# EAGLE schematic Relayschematic (EAGLE 7.5.0)
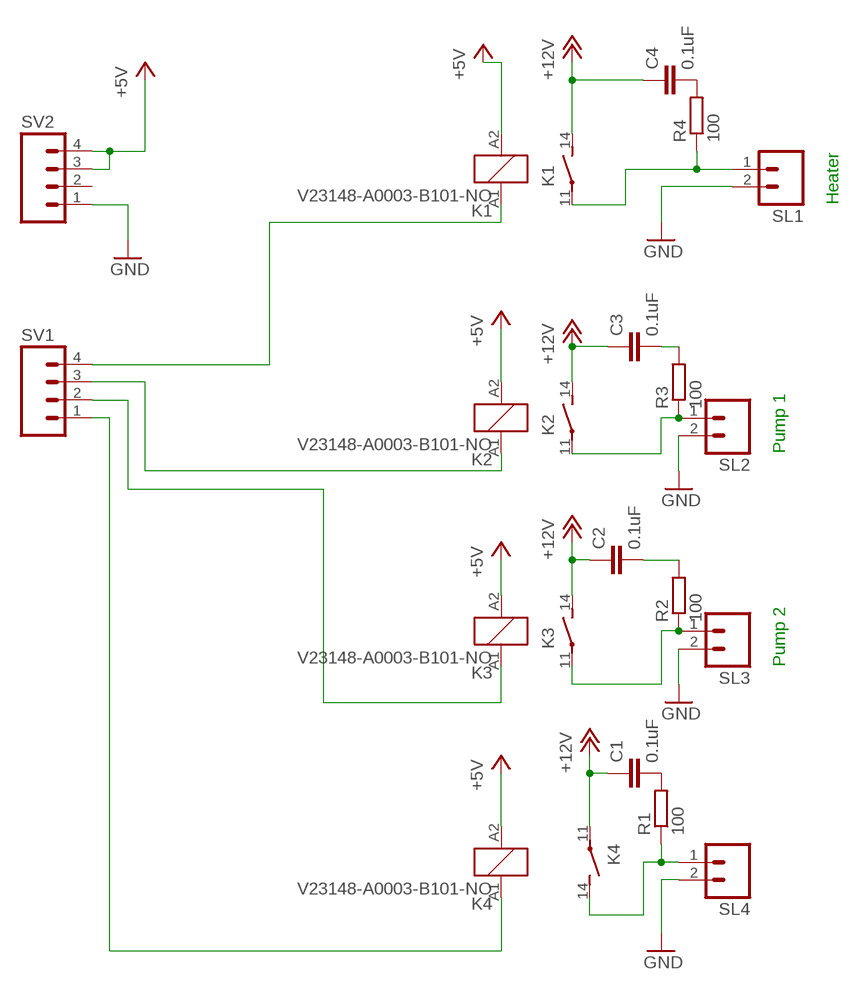
[diagram p0: schematic, sheet 1]

## Parts
C1  0.1uF  C5/2.5  [C5B2.5]
C2  0.1uF  C5/2.5  [C5B2.5]
C3  0.1uF  C5/2.5  [C5B2.5]
C4  0.1uF  C5/2.5  [C5B2.5]
K1  V23148-A0003-B101-NO  [V23148-NO]
K2  V23148-A0003-B101-NO  [V23148-NO]
K3  V23148-A0003-B101-NO  [V23148-NO]
K4  V23148-A0003-B101-NO  [V23148-NO]
R1  100  R-EU_0207/10  [0207/10]
R2  100  R-EU_0207/10  [0207/10]
R3  100  R-EU_0207/10  [0207/10]
R4  100  R-EU_0207/10  [0207/10]
SL1  MA02  [02PA]
SL2  MA02  [02PA]
SL3  MA02  [02PA]
SL4  MA02  [02PA]
SV1  MA04  [04PA]
SV2  MA04  [04PA]

## Nets
+5V: K1.A2 K2.A2 K3.A2 K4.A2 SV2.3 SV2.4
+12V: C1.1 C2.1 C3.1 C4.1 K1.14(2:S) K2.14(2:S) K3.14(2:S) K4.11(2:P)
GND: SL1.2 SL2.2 SL3.2 SL4.2 SV2.1
N$1: K1.A1 SV1.4
N$2: C4.2 R4.2
N$3: K2.A1 SV1.3
N$4: K4.A1 SV1.1
N$5: K3.A1 SV1.2
N$6: C3.2 R3.2
N$7: C2.2 R2.2
N$8: K4.14(2:S) R1.1 SL4.1
N$9: K1.11(2:P) R4.1 SL1.1
N$10: K2.11(2:P) R3.1 SL2.1
N$11: K3.11(2:P) R2.1 SL3.1
N$12: C1.2 R1.2
Unconnected: SV2.2

## Notes on the sheet
- Heater
- Pump 1
- Pump 2

## Library data of the parts
C1-C4 = capacitor-wima:C: CAPACITOR naming: grid - package width
K1-K4 = relay:V23148-*-NO: Power PCB Relay U/UB normal open tyco/electronics; 1 pole 7 A, mono or bistabile www.schrackrelays.com/pdf/UUB.pdf; MPN: V23148-A0007-A101; OC_FARNELL: 1175042; OC_NEWARK: 48M9078
R1-R4 = resistor:R-EU_: RESISTOR, European symbol
SL1-SL4 = con-amp-quick:MA02: AMP QUICK CONNECTOR; OC_FARNELL: unknown; OC_NEWARK: unknown
SV1 SV2 = con-amp-quick:MA04: AMP QUICK CONNECTOR; OC_FARNELL: unknown; OC_NEWARK: unknown